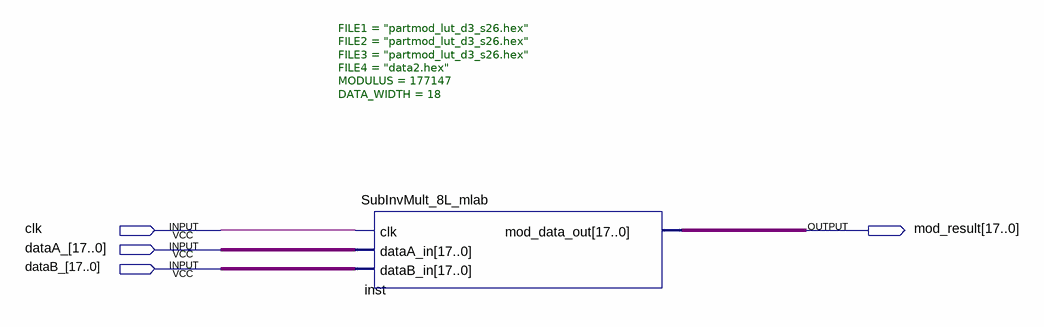
[diagram p0: schematic sheet]
// Quartus schematic SubInvMult_8L_mlab_tst.bdf as structural Verilog: 1 symbols, 4 pins
module SubInvMult_8L_mlab_tst (
  input  clk,
  input  [17:0] dataA_,
  input  [17:0] dataB_,
  output [17:0] mod_result
);

  SubInvMult_8L_mlab #(.FILE1("partmod_lut_d3_s26.hex"), .FILE2("partmod_lut_d3_s26.hex"), .FILE3("partmod_lut_d3_s26.hex"), .FILE4("data2.hex"), .MODULUS(177147), .DATA_WIDTH(18)) inst (
    .clk(clk), .dataA_in(dataA_), .dataB_in(dataB_), .mod_data_out(mod_result));
endmodule
